# EAGLE design BBB_I2S_CAPE (EAGLE 7.5.0)
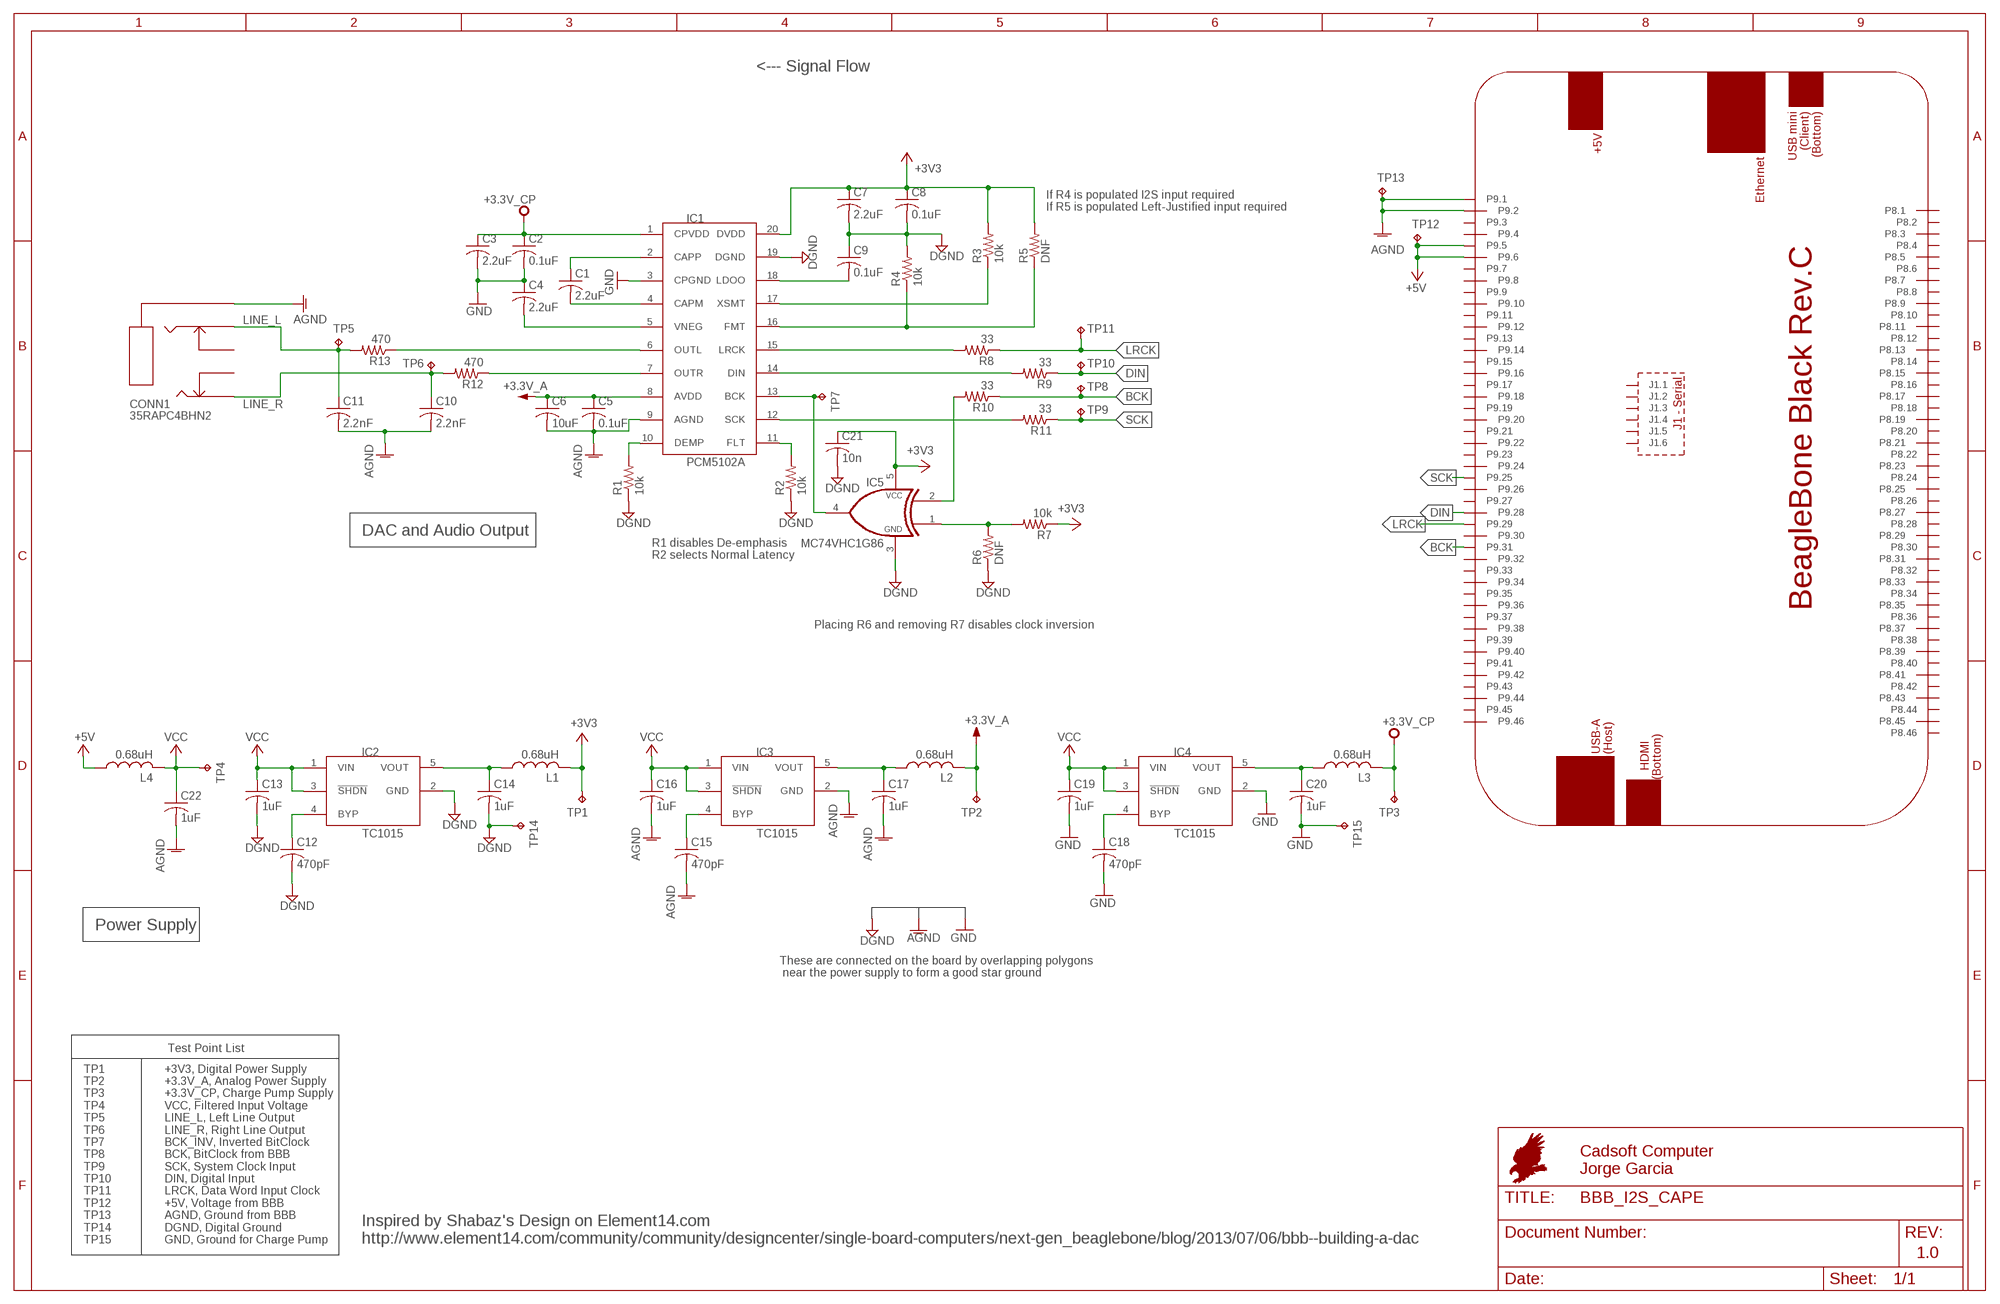
[diagram p0: schematic, sheet 1]

## Parts
C1  2.2uF  C-USC0805  [C0805]
C2  0.1uF  C-USC0805  [C0805]
C3  2.2uF  C-USC0805  [C0805]
C4  2.2uF  C-USC0805  [C0805]
C5  0.1uF  C-USC0805  [C0805]
C6  10uF  C-USC0805  [C0805]
C7  2.2uF  C-USC0805  [C0805]
C8  0.1uF  C-USC0805  [C0805]
C9  0.1uF  C-USC0805  [C0805]
C10  2.2nF  C-USC0805  [C0805]
C11  2.2nF  C-USC0805  [C0805]
C12  470pF  C-USC0805  [C0805]
C13  1uF  C-USC0805  [C0805]
C14  1uF  C-USC0805  [C0805]
C15  470pF  C-USC0805  [C0805]
C16  1uF  C-USC0805  [C0805]
C17  1uF  C-USC0805  [C0805]
C18  470pF  C-USC0805  [C0805]
C19  1uF  C-USC0805  [C0805]
C20  1uF  C-USC0805  [C0805]
C21  10n  C-USC0805  [C0805]
C22  1uF  C-USC0805  [C0805]
CONN1  35RAPC4BHN2  [35RAPC4BHN2]
IC1  PCM5102A  [TSSOP20]
IC2  TC1015  [SOT23-5L]
IC3  TC1015  [SOT23-5L]
IC4  TC1015  [SOT23-5L]
IC5  MC74VHC1G86  [SOT23-5L]
L1  0.68uH  INDUCTOR  [R0805]
L2  0.68uH  INDUCTOR  [R0805]
L3  0.68uH  INDUCTOR  [R0805]
L4  0.68uH  INDUCTOR  [R0805]
PCB1  BEAGLEBONE_BLACK_CAPE  [BEAGLEBONE_BLACK_CAPE]
R1  10k  R-US_R0805  [R0805]
R2  10k  R-US_R0805  [R0805]
R3  10k  R-US_R0805  [R0805]
R4  10k  R-US_R0805  [R0805]
R5  DNF  R-US_R0805  [R0805]
R6  DNF  R-US_R0805  [R0805]
R7  10k  R-US_R0805  [R0805]
R8  33  R-US_R0805  [R0805]
R9  33  R-US_R0805  [R0805]
R10  33  R-US_R0805  [R0805]
R11  33  R-US_R0805  [R0805]
R12  470  R-US_R0805  [R0805]
R13  470  R-US_R0805  [R0805]
TP1  TPPAD1-17  [P1-17]
TP2  TPPAD1-17  [P1-17]
TP3  TPPAD1-17  [P1-17]
TP4  TPPAD1-17  [P1-17]
TP5  TPPAD1-17  [P1-17]
TP6  TPPAD1-17  [P1-17]
TP7  TPPAD1-17  [P1-17]
TP8  TPPAD1-17  [P1-17]
TP9  TPPAD1-17  [P1-17]
TP10  TPPAD1-17  [P1-17]
TP11  TPPAD1-17  [P1-17]
TP12  TPPAD1-17  [P1-17]
TP13  TPPAD1-17  [P1-17]
TP14  TPPAD1-17  [P1-17]
TP15  TPPAD1-17  [P1-17]

## Nets
+3.3V_A: C5.1 C6.1 IC1.8(AVDD) L2.2 TP2.TP
+3.3V_CP: C2.1 C3.1 IC1.1(CPVDD) L3.2 TP3.TP
+3V3: C7.1 C8.1 C21.1 IC1.20(DVDD) IC5.5(VCC) L1.2 R3.2 R5.2 R7.1 TP1.TP
+5V: L4.1 PCB1.P9.5 PCB1.P9.6 TP12.TP
AGND: C5.2 C6.2 C10.2 C11.2 C15.2 C16.2 C17.2 C22.2 CONN1.1 IC1.9(AGND) IC3.2(GND) PCB1.P9.1 PCB1.P9.2 TP13.TP
BCK: PCB1.P9.31 R10.1 TP8.TP
BCK_INV: IC1.13(BCK) IC5.4(OUT) TP7.TP
DGND: C7.2 C8.2 C9.1 C12.2 C13.2 C14.2 C21.2 IC1.19(DGND) IC2.2(GND) IC5.3(GND) R1.1 R2.1 R4.2 R6.1 TP14.TP
DIN: PCB1.P9.28 R9.1 TP10.TP
GND: C2.2 C3.2 C4.1 C18.2 C19.2 C20.2 IC1.3(CPGND) IC4.2(GND) TP15.TP
LINE_L: C11.1 CONN1.3 R13.2 TP5.TP
LINE_R: C10.1 CONN1.2 R12.2 TP6.TP
LRCK: PCB1.P9.29 R8.1 TP11.TP
N$1: C1.2 IC1.4(CAPM)
N$2: C1.1 IC1.2(CAPP)
N$3: C4.2 IC1.5(VNEG)
N$4: IC1.15(LRCK) R8.2
N$5: IC1.17(XSMT) R3.1
N$6: IC1.14(DIN) R9.2
N$7: IC1.10(DEMP) R1.2
N$8: IC1.11(FLT) R2.2
N$9: IC5.2(INA) R10.2
N$11: C9.2 IC1.18(LDOO)
N$12: IC5.1(INB) R6.2 R7.2
N$13: IC1.16(FMT) R4.1 R5.1
N$15: IC1.12(SCK) R11.2
N$18: IC1.7(OUTR) R12.1
N$20: IC1.6(OUTL) R13.1
N$22: C12.1 IC2.4(BYP)
N$24: C14.1 IC2.5(VOUT) L1.1
N$25: C15.1 IC3.4(BYP)
N$27: C17.1 IC3.5(VOUT) L2.1
N$28: C18.1 IC4.4(BYP)
N$30: C20.1 IC4.5(VOUT) L3.1
SCK: PCB1.P9.25 R11.1 TP9.TP
VCC: C13.1 C16.1 C19.1 C22.1 IC2.1(VIN) IC2.3(!SHDN) IC3.1(VIN) IC3.3(!SHDN) IC4.1(VIN) IC4.3(!SHDN) L4.2 TP4.TP
Unconnected: CONN1.10 CONN1.11 PCB1.J1.1 PCB1.J1.2 PCB1.J1.3 PCB1.J1.4 PCB1.J1.5 PCB1.J1.6 PCB1.P8.1 PCB1.P8.2 PCB1.P8.3 PCB1.P8.4 PCB1.P8.5 PCB1.P8.6 PCB1.P8.7 PCB1.P8.8 PCB1.P8.9 PCB1.P8.10 PCB1.P8.11 PCB1.P8.12 PCB1.P8.13 PCB1.P8.14 PCB1.P8.15 PCB1.P8.16 PCB1.P8.17 PCB1.P8.18 PCB1.P8.19 PCB1.P8.20 PCB1.P8.21 PCB1.P8.22 PCB1.P8.23 PCB1.P8.24 PCB1.P8.25 PCB1.P8.26 PCB1.P8.27 PCB1.P8.28 PCB1.P8.29 PCB1.P8.30 PCB1.P8.31 PCB1.P8.32 PCB1.P8.33 PCB1.P8.34 PCB1.P8.35 PCB1.P8.36 PCB1.P8.37 PCB1.P8.38 PCB1.P8.39 PCB1.P8.40 PCB1.P8.41 PCB1.P8.42 PCB1.P8.43 PCB1.P8.44 PCB1.P8.45 PCB1.P8.46 PCB1.P9.3 PCB1.P9.4 PCB1.P9.7 PCB1.P9.8 PCB1.P9.9 PCB1.P9.10 PCB1.P9.11 PCB1.P9.12 PCB1.P9.13 PCB1.P9.14 PCB1.P9.15 PCB1.P9.16 PCB1.P9.17 PCB1.P9.18 PCB1.P9.19 PCB1.P9.20 PCB1.P9.21 PCB1.P9.22 PCB1.P9.23 PCB1.P9.24 PCB1.P9.26 PCB1.P9.27 PCB1.P9.30 PCB1.P9.32 PCB1.P9.33 PCB1.P9.34 PCB1.P9.35 PCB1.P9.36 PCB1.P9.37 PCB1.P9.38 PCB1.P9.39 PCB1.P9.40 PCB1.P9.41 PCB1.P9.42 PCB1.P9.43 PCB1.P9.44 PCB1.P9.45 PCB1.P9.46

## Notes on the sheet
- <--- Signal Flow
- If R4 is populated I2S input required
  If R5 is populated Left-Justified input required
- DAC and Audio Output
- R1 disables De-emphasis
  R2 selects Normal Latency
- Placing R6 and removing R7 disables clock inversion
- Power Supply
- These are connected on the board by overlapping polygons
   near the power supply to form a good star ground
- Test Point List
- Cadsoft Computer
  Jorge Garcia
- TP1
  TP2
  TP3
  TP4
  TP5
  TP6
  TP7
  TP8
  TP9
  TP10
  TP11
  TP12
  TP13
  TP14
  TP15
- +3V3, Digital Power Supply
  +3.3V_A, Analog Power Supply
  +3.3V_CP, Charge Pump Supply
  VCC, Filtered Input Voltage
  LINE_L, Left Line Output
  LINE_R, Right Line Output
  BCK_INV, Inverted BitClock
  BCK, BitClock from BBB
  SCK, System Clock Input
  DIN, Digital Input
  LRCK, Data Word Input Clock
  +5V, Voltage from BBB
  AGND, Ground from BBB
  DGND, Digital Ground
  GND, Ground for Charge Pump
- Inspired by Shabaz's Design on Element14.com
  http://www.element14.com/community/community/designcenter/single-board-computers/next-gen_beaglebone/blog/2013/07/06/bbb--building-a-dac
- 1.0

## Library data of the parts
C1 C3 C4 C7 = rcl:C-US: CAPACITOR, American symbol; MPN: GCM21BR71C225KA64L; OC_NEWARK: 55Y9834
C2 C5 C8 C9 = rcl:C-US: CAPACITOR, American symbol; MF: VISHAY/VITRAMON; MPN: VJ0805Y104KXAMT; OC_NEWARK: 07J8753
C6 = rcl:C-US: CAPACITOR, American symbol; MPN: 08053D106KAT2A; OC_NEWARK: 37T9053
C10 C11 = rcl:C-US: CAPACITOR, American symbol; MF: AVX CORPORATION; MPN: 08055C222KAT2A; OC_NEWARK: 19C6333
C12 C15 C18 = rcl:C-US: CAPACITOR, American symbol; MPN: MC0805B471K500CT; OC_NEWARK: 06R3855
C13 C14 C16 C17 C19 C20 C22 = rcl:C-US: CAPACITOR, American symbol; MPN: C0805X105K3RACAUTO; OC_NEWARK: 47Y9746
C21 = rcl:C-US: CAPACITOR, American symbol; MPN: MC0805B103K500CT; OC_NEWARK: 06R3733
CONN1 = BBB_WIFI_RADIO:35RAPC4BHN2; MF: SWITCHCRAFT; MPN: 35RAPC4BHN2; OC_NEWARK: 96F9607
IC1 = BBB_WIFI_RADIO:PCM5102A; MPN: PCM5102AQPWRQ1; OC_NEWARK: 49X0828
IC2-IC4 = BBB_WIFI_RADIO:TC1015: TC1014 LDO; MPN: TC1015-3.3VCT713; OC_NEWARK: 34M8764
IC5 = BBB_WIFI_RADIO:MC74VHC1G86: High-Speed 2 input xor gate; MF: TEXAS INSTRUMENTS; MPN: SN74AHC1G86DBVR; OC_NEWARK: 10C2398
L1-L4 = BBB_WIFI_RADIO:INDUCTOR; MPN: MCFT000156; OC_NEWARK: 10R8691
PCB1 = e14_BeagleBoneBlack_RevB:BEAGLEBONE_BLACK_CAPE; OC_NEWARK: unknown
R1-R4 R7 = rcl:R-US_: RESISTOR, American symbol; MPN: MCTC0525B1002T5E; OC_NEWARK: 01N7380
R5 R6 = rcl:R-US_: RESISTOR, American symbol; OC_NEWARK: unknown
R8-R11 = rcl:R-US_: RESISTOR, American symbol; MPN: CR0805-JW-330ELF; OC_NEWARK: 06X5177
R12 R13 = rcl:R-US_: RESISTOR, American symbol; MPN: ERA-6AEB471V; OC_NEWARK: 08N2174
TP1-TP15 = testpad:TP: Test pad; OC_NEWARK: unknown

## Board
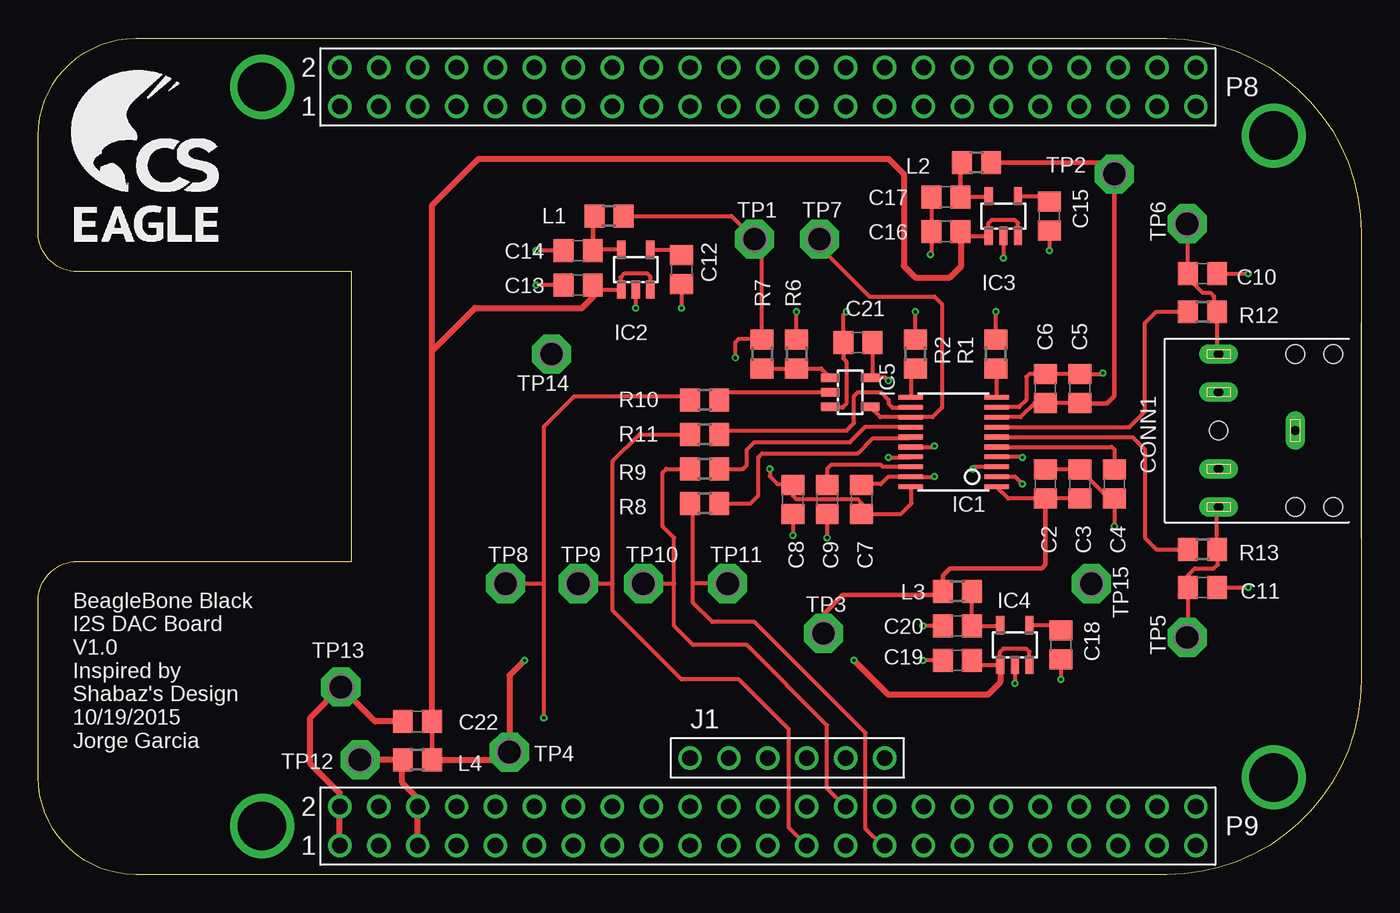
[diagram p1: board, top side]
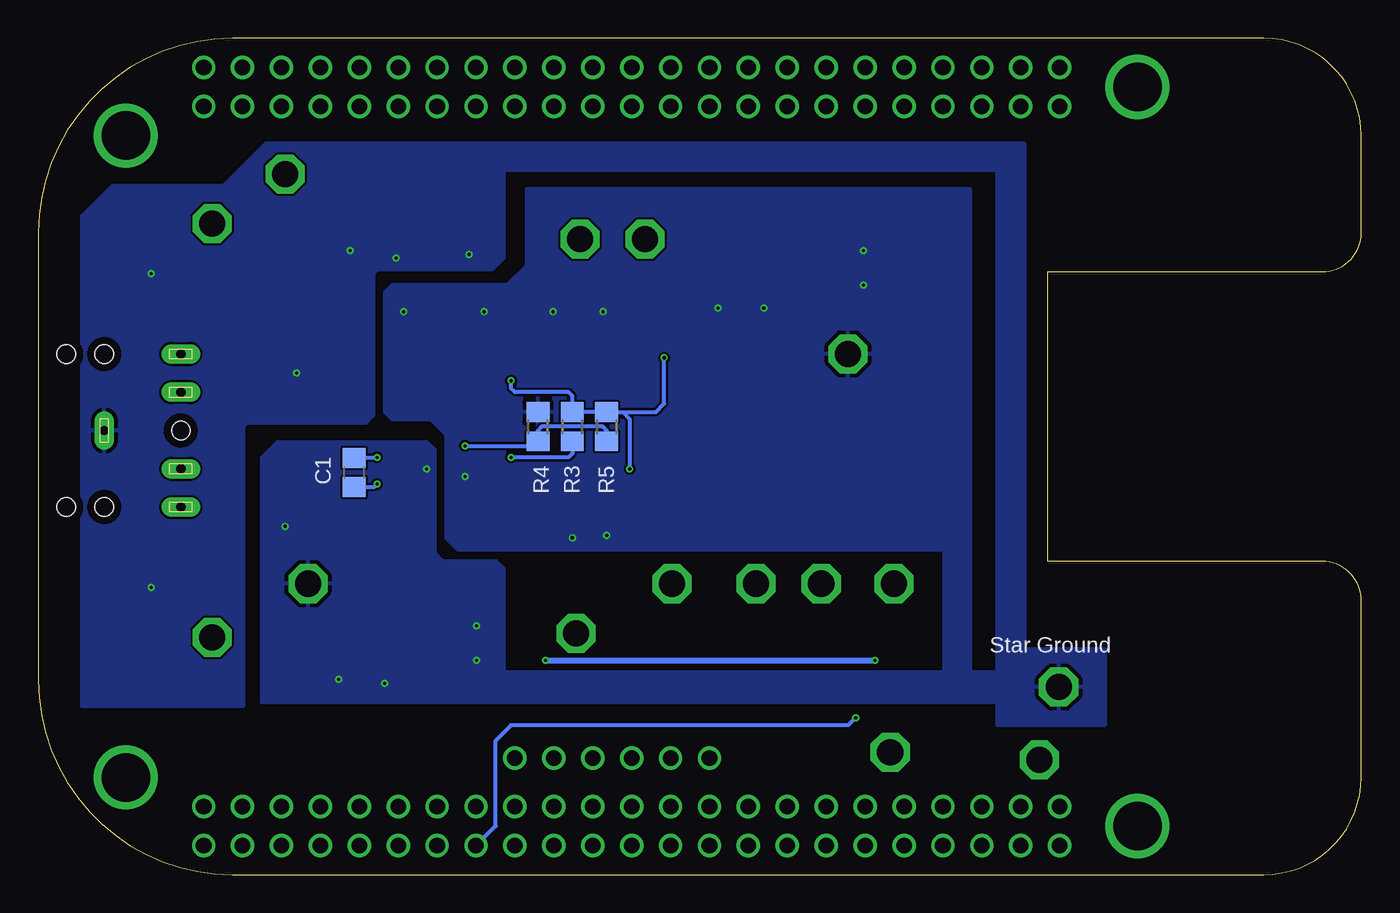
[diagram p2: board, bottom side, seen from below]

Size 86.36 x 54.61 mm. Coordinates in mm from the lower left corner, seen from the top.
Copper layers (1*16): Top 0.035mm / dielectric 1.5mm / Bottom 0.035mm
Design rules "default *": minimum track width 6mil, minimum drill 8mil, track to track 6mil, track to pad 6mil, pad to pad 6mil, via to via 6mil, smd to smd 6mil, copper to edge 20mil, drill to drill 8mil, minimum pad ring 5mil, minimum via ring 5mil, stop-mask expansion 4mil, vias tented up to drill 0mil, thermal gap 10mil

### Footprints (pad centres in the part's own frame; a part is rotated, then mirrored left to right if it is on the bottom)
C0805 = smd 1.3 x 1.5: 1 -0.95,0; 2 0.95,0
35RAPC4BHN2 = drill 0.6 pad 1.27 long: 1 -5,0; 2 0,-5; 3 0,5; 10 0,-2.5; 11 0,2.5 | hole 1.2: 0,0; -5,5; -7.5,5; -5,-5; -7.5,-5
TSSOP20 = smd 0.3 x 1.6: 1 -2.925,-2.8; 2 -2.275,-2.8; 3 -1.625,-2.8; 4 -0.975,-2.8; 5 -0.325,-2.8; 6 0.325,-2.8; 7 0.975,-2.8; 8 1.625,-2.8; 9 2.275,-2.8; 10 2.925,-2.8; 11 2.925,2.8; 12 2.275,2.8; 13 1.625,2.8; 14 0.975,2.8; 15 0.325,2.8; 16 -0.325,2.8; 17 -0.975,2.8; 18 -1.625,2.8; 19 -2.275,2.8; 20 -2.925,2.8
SOT23-5L = smd 0.55 x 1.2: 1 -0.95,-1.3; 2 0,-1.3; 3 0.95,-1.3; 4 0.95,1.3; 5 -0.95,1.3
R0805 = smd 1.3 x 1.5: 1 -0.95,0; 2 0.95,0
BEAGLEBONE_BLACK_CAPE = drill 3.175: H1 14.605,3.175; H2 80.645,6.35; H3 80.645,48.26; H4 14.605,51.435 | drill 1.016: J1.1 42.545,7.62; J1.2 45.085,7.62; J1.3 47.625,7.62; J1.4 50.165,7.62; J1.5 52.705,7.62; J1.6 55.245,7.62; P8.1 19.685,50.165; P8.2 19.685,52.705; P8.3 22.225,50.165; P8.4 22.225,52.705; P8.5 24.765,50.165; P8.6 24.765,52.705; P8.7 27.305,50.165; P8.8 27.305,52.705; P8.9 29.845,50.165; P8.10 29.845,52.705; P8.11 32.385,50.165; P8.12 32.385,52.705; P8.13 34.925,50.165; P8.14 34.925,52.705; P8.15 37.465,50.165; P8.16 37.465,52.705; P8.17 40.005,50.165; P8.18 40.005,52.705; P8.19 42.545,50.165; P8.20 42.545,52.705; P8.21 45.085,50.165; P8.22 45.085,52.705; P8.23 47.625,50.165; P8.24 47.625,52.705; P8.25 50.165,50.165; P8.26 50.165,52.705; P8.27 52.705,50.165; P8.28 52.705,52.705; P8.29 55.245,50.165; P8.30 55.245,52.705; P8.31 57.785,50.165; P8.32 57.785,52.705; P8.33 60.325,50.165; P8.34 60.325,52.705; P8.35 62.865,50.165; P8.36 62.865,52.705; P8.37 65.405,50.165; P8.38 65.405,52.705; P8.39 67.945,50.165; P8.40 67.945,52.705; P8.41 70.485,50.165; P8.42 70.485,52.705; P8.43 73.025,50.165; P8.44 73.025,52.705; P8.45 75.565,50.165; P8.46 75.565,52.705; P9.1 19.685,1.905; P9.2 19.685,4.445; P9.3 22.225,1.905; P9.4 22.225,4.445; P9.5 24.765,1.905; P9.6 24.765,4.445; P9.7 27.305,1.905; P9.8 27.305,4.445; P9.9 29.845,1.905; P9.10 29.845,4.445; P9.11 32.385,1.905; P9.12 32.385,4.445; P9.13 34.925,1.905; P9.14 34.925,4.445; P9.15 37.465,1.905; P9.16 37.465,4.445; P9.17 40.005,1.905; P9.18 40.005,4.445; P9.19 42.545,1.905; P9.20 42.545,4.445; P9.21 45.085,1.905; P9.22 45.085,4.445; P9.23 47.625,1.905; P9.24 47.625,4.445; P9.25 50.165,1.905; P9.26 50.165,4.445; P9.27 52.705,1.905; P9.28 52.705,4.445; P9.29 55.245,1.905; P9.30 55.245,4.445; P9.31 57.785,1.905; P9.32 57.785,4.445; P9.33 60.325,1.905; P9.34 60.325,4.445; P9.35 62.865,1.905; P9.36 62.865,4.445; P9.37 65.405,1.905; P9.38 65.405,4.445; P9.39 67.945,1.905; P9.40 67.945,4.445; P9.41 70.485,1.905; P9.42 70.485,4.445; P9.43 73.025,1.905; P9.44 73.025,4.445; P9.45 75.565,1.905; P9.46 75.565,4.445
P1-17 = drill 1.702 pad 2.54 octagon: TP 0,0

### Placement (x,y rotation side)
C1  65.75,26.25 90 bottom
C2  65.75,25.5 90 top
C3  68,25.5 90 top
C4  70.25,25.5 90 top
C5  68,31.75 90 top
C6  65.75,31.75 90 top
C7  53.75,24.5 90 top
C8  49.25,24.5 270 top
C9  51.5,24.5 90 top
C10  76,39.25 0 top
C11  76,18.75 0 top
C12  42,39.5 270 top
C13  35.25,38.5 180 top
C14  35.25,40.75 180 top
C15  66,43 270 top
C16  59.25,42 180 top
C17  59.25,44.25 180 top
C18  66.75,15 270 top
C19  60,14 180 top
C20  60,16.25 180 top
C21  53.5,34.75 180 top
C22  24.75,10 180 top
CONN1  77.05,29 180 top
IC1  59.75,28.25 90 top
IC2  39,39.5 0 top
IC3  63,43 0 top
IC4  63.75,15 0 top
IC5  53,31.5 270 top
L1  37.25,43 0 top
L2  61.25,46.5 0 top
L3  60,18.5 180 top
L4  24.75,7.5 0 top
PCB1  0,0 0 top
R1  62.5,34 270 top
R2  57.25,34 270 top
R3  51.5,29.25 90 bottom
R4  53.75,29.25 90 bottom
R5  49.25,29.25 90 bottom
R6  49.5,34 270 top
R7  47.25,34 270 top
R8  43.5,24.25 0 top
R9  43.5,26.5 0 top
R10  43.5,31 0 top
R11  43.5,28.75 0 top
R12  76,36.75 0 top
R13  76,21.25 0 top
TP1  46.75,41.5 0 top
TP2  70.25,45.75 180 top
TP3  51.25,15.75 0 top
TP4  30.75,8 0 top
TP5  75,15.5 90 top
TP6  75,42.5 90 top
TP7  51,41.5 0 top
TP8  30.5,19 0 top
TP9  35.25,19 0 top
TP10  39.5,19 0 top
TP11  45,19 0 top
TP12  21,7.5 0 top
TP13  19.75,12.25 0 top
TP14  33.5,34 180 top
TP15  68.75,19 270 top

### Tracks (layer width: path | path; a pad name or v marks a point on that pad's centre or on a via)
+3.3V_A
  Top 0.254: C5.1 C6.1 65.05,30.8 64.12,29.88 IC1.8
  Top 0.305: L2.2 69.5,46.5 TP2.TP 70.25,31.25 69.75,30.75 68.05,30.75 C5.1
+3.3V_CP
  Top 0.254: C3.1 C2.1 63.33,24.55 IC1.1
  Top 0.305: C2.1 65.75,20.25 65.5,20 59.5,20 59.05,19.55 L3.2 58.8,18.25 52.5,18.25 51.25,17 TP3.TP
+3V3  (via drill 0.2)
  Top 0.254: IC1.20 57,25.27 57,24.25 56.3,23.55 C7.1 53.75,24.25 53.5,24.5 49.5,24.5 49.25,24.75 C8.1 | C21.1 54.45,32.6 IC5.5 55.3,32.45 v55.5,32.25 | L1.2 45.25,43 TP1.TP 47.25,41 R7.1 47.2,35 45.75,35 45.5,34.75 v45.5,33.75 | 49.3,25.5 C8.1 | v47.75,26.5 47.75,26 48.25,25.5 49.2,25.5 C8.1
  Bottom 0.254: 48.2,30.2 R5.2 R3.2 51.5,31.25 51.75,31.5 55.25,31.5 55.5,31.75 v55.5,32.25 | 48.2,30.2 47.75,29.75 v47.75,26.5 | 48.2,30.2 46.05,30.2 45.5,30.75 v45.5,33.75
+5V
  Top 0.406: PCB1.P9.5 PCB1.P9.6 24.77,4.99 23.75,6 23.75,7.45 L4.1 TP12.TP
AGND  (via drill 0.2)
  Top 0.254: IC1.9 64.03,30.52 64.5,31 64.5,32.5 64.7,32.7 C6.2 C5.2 69.45,32.7 v69.5,32.75 | C11.2 v79,18.75 | C10.2 v79,39.25 | IC3.2 v63,40.25 | C15.2 v66,40.75 | C17.2 C16.2 58.3,40.55 v58.25,40.5
  Top 0.406: PCB1.P9.1 PCB1.P9.2 19.68,5.32 17.75,7.25 17.75,10.25 TP13.TP 22,10 C22.2
  pour Bottom: 71.5,47.75 22,47.75 22,14.75 16.75,14.75 16.75,9.75 23.75,9.75 23.75,46 56,46 56,40.25 56.75,39.5 64.25,39.5 64.5,39.25 64.5,30 65,29.5 72.75,29.5 73,29.25 73,11 83.5,11 83.5,43 81.5,45 74.25,45
BCK  (via drill 0.2)
  Top 0.254: v33,10.25 33,19 | 33,19 33,29.25 35,31.25 42.3,31.25 R10.1 | TP8.TP 33,19
  Bottom 0.254: PCB1.P9.31 56.5,3.19 56.5,8.75 55.5,9.75 33.5,9.75 v33,10.25
BCK_INV
  Top 0.254: IC5.4 54.98,29.88 IC1.13 58.38,29.88 59,30.5 59,37.25 58.5,37.75 54.25,37.75 51,41 TP7.TP
DGND  (via drill 0.2)
  Top 0.254: v58.5,26 58.48,25.98 IC1.19 55.48,25.98 55,25.5 53.8,25.5 C7.2 | IC5.3 51.75,30.5 52.5,30.5 52.75,30.75 52.75,33.5 52.55,33.7 C21.2 52.55,36.55 v52.75,36.75 | C12.2 v42,37 | IC2.2 v39,37 | C13.2 v32.5,38.5 | C14.2 v32.5,40.75 | R2.1 v57.25,36.75 | R1.1 v62.5,36.75 | R6.1 v49.5,36.75 | C8.2 v49.25,22.15 | C9.1 v51.5,22
  pour Bottom: 25.5,44.75 54.5,44.75 54.5,39.75 55.75,38.5 63.25,38.5 63.75,38 63.75,30.25 63.25,29.75 60.75,29.75 59.75,28.75 59.75,22 59,21.25 27.25,21.25 27.25,12.25 25.5,12.25
DIN
  Top 0.254: PCB1.P9.28 51.5,5.65 51.5,9.75 46.25,15 42.75,15 41.5,16.25 41.5,19 | 41.5,19 41.5,22 40.75,22.75 40.75,26.25 41,26.5 R9.1 | TP10.TP 41.5,19
GND  (via drill 0.2)
  Top 0.254: IC1.3 61.12,26.62 v61,26.5 | 65.58,26.62 C2.2 C3.2 69.9,24.55 C4.1 v70.25,22.75 | C18.2 v66.75,12.75 | IC4.2 v63.75,12.5 | C20.2 v57.75,16.25 | C19.2 v57.75,14
  pour Bottom: 56,13.25 23,13.25 23,11.25 71.75,11.25 71.75,27.25 70.75,28.25 61,28.25 60.5,27.75 60.5,21 60,20.5 56.5,20.5 56,20
LINE_L
  Top 0.254: CONN1.3 76.95,23.9 R13.2 77,21.2 77,20.25 76.75,20 75.5,20 75.05,19.55 C11.1 75.05,15.55 TP5.TP
LINE_R
  Top 0.254: CONN1.2 76.95,34.1 R12.2 76.75,36.95 76.75,37.75 76.5,38 76,38 75.05,38.95 C10.1 75.05,42.45 TP6.TP
LRCK
  Top 0.254: PCB1.P9.29 55.09,1.91 54,3 54,9.25 46.75,16.5 44,16.5 42.75,17.75 42.75,19 | 42.75,19 42.75,24.05 R8.1 | TP11.TP 42.75,19
N$1  (via drill 0.2)
  Top 0.254: v64.25,27.25 64.22,27.27 IC1.4
  Bottom 0.254: C1.2 65.7,27.25 v64.25,27.25
N$2  (via drill 0.2)
  Top 0.254: v64.25,25.5 63.77,25.98 IC1.2
  Bottom 0.254: C1.1 64.45,25.3 v64.25,25.5
N$3
  Top 0.254: IC1.5 70.08,27.93 70.25,27.75 C4.2
N$4
  Top 0.254: R8.2 46.5,24.25 47,24.75 47,27.25 47.25,27.5 53.5,27.5 54.5,28.5 56.88,28.5 IC1.15
N$5  (via drill 0.2)
  Top 0.254: v55.5,27.25 56.92,27.25 IC1.17
  Bottom 0.254: R3.1 51.5,27.5 51.75,27.25 v55.5,27.25
N$6
  Top 0.254: R9.2 46,26.5 46.25,26.75 46.25,27.75 46.75,28.25 53,28.25 54,29.25 56.92,29.25 IC1.14
N$7
  Top 0.254: R1.2 62.55,33 IC1.10
N$8
  Top 0.254: R2.2 56.95,32.75 IC1.11
N$9
  Top 0.254: R10.2 44.95,31.5 IC5.2
N$11
  Top 0.254: IC1.18 55.12,26.62 55,26.75 51.75,26.75 51.5,26.5 C9.2
N$12
  Top 0.254: R7.2 R6.2 51.1,33.05 IC5.1
N$13  (via drill 0.2)
  Top 0.254: IC1.16 58.42,27.93 v58.5,28
  Bottom 0.254: R5.1 49.25,29 49.5,29.25 53.5,29.25 53.75,29 R4.1 54.05,28 v58.5,28
N$15
  Top 0.254: R11.2 44.7,29 52.75,29 53.25,29.5 53.25,31.25 53.5,31.5 55,31.5 55.5,31 55.5,30.75 55.75,30.5 56.92,30.5 IC1.12
N$18
  Top 0.254: IC1.7 71.22,29.23 72.25,30.25 72.25,36 73,36.75 R12.1
N$20
  Top 0.254: IC1.6 71.42,28.57 72.25,27.75 72.25,22 73,21.25 R13.1
N$22
  Top 0.254: IC2.4 41.65,40.8 C12.1
N$24
  Top 0.254: IC2.5 36.25,40.8 C14.1
  Top 0.305: C14.1 36.2,42.9 L1.1
N$25
  Top 0.254: IC3.4 65.65,44.3 C15.1
N$27
  Top 0.254: IC3.5 62,44.25 C17.1
  Top 0.305: C17.1 60.2,46.4 L2.1
N$28
  Top 0.254: IC4.4 66.4,16.3 C18.1
N$30
  Top 0.254: L3.1 C20.1 62.75,16.25 IC4.5
SCK
  Top 0.254: PCB1.P9.25 49,3.07 49,9.5 45.75,12.75 42,12.75 37.5,17.25 37.5,19 | 37.5,19 37.5,27 39.25,28.75 R11.1 | TP9.TP 37.5,19
VCC  (via drill 0.2)
  Top 0.254: IC2.3 39.95,39.05 39.75,39.25 38.25,39.25 38,39 38,38.25 IC2.1 36.5,38.2 C13.1 | C16.1 60.5,41.7 IC3.1 62,41.75 62,42.5 62.25,42.75 63.75,42.75 63.95,42.55 IC3.3 | IC4.3 64.7,14.55 64.5,14.75 63,14.75 62.75,14.5 62.75,13.75 IC4.1 61.25,13.7 C19.1
  Top 0.305: L4.2 C22.1
  Top 0.406: L4.2 30.25,7.5 TP4.TP 30.75,13 v31.75,14 | C22.1 25.7,34.2 | 25.7,34.2 28.5,37 35.5,37 36.25,37.75 36.25,38.45 C13.1 | 25.7,34.2 25.7,43.7 28.75,46.75 55.5,46.75 56.5,45.75 56.5,39.75 57.25,39 59.5,39 60.25,39.75 60.25,41.95 C16.1 | IC4.1 62.8,12.55 62,11.75 55.5,11.75 v53.25,14
  Bottom 0.406: v53.25,14 v31.75,14

### Text on the board
tPlace: BeagleBone Black / I2S DAC Board / V1.0 / Inspired by / Shabaz's Design / 10/19/2015 / Jorge Garcia
bPlace: Star Ground